# EAGLE design Cellphone-Detector-LM358 (EAGLE 7.2.0)
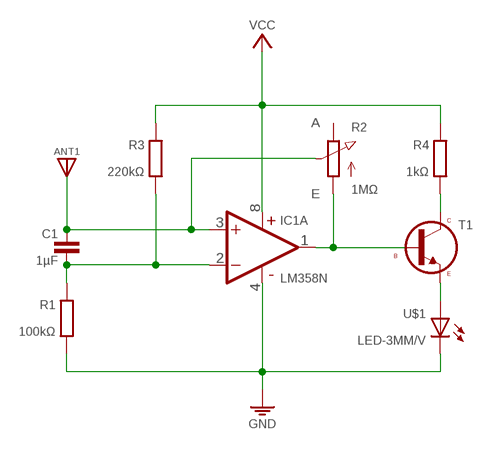
[diagram p0: schematic, sheet 1]

## Parts
ANT1  ANT  [SPAD]
C1  1µF  C025-024X044  [C025-024X044]
IC1  LM358N  [DIL08]
R1  100kΩ  R0202/7-V  [0202/7-V]
R2  1MΩ  POT-V  [POT-V]
R3  220kΩ  R0204/10-V  [0204/10-V]
R4  1kΩ  R0204/10-V  [0204/10-V]
S1  VCC_GNDPWR-R  [PWR-R]
T1  BC547  [TO92]
U$1  LED-3MM/V  [LED_3MM/V]

## Nets
GND: IC1.4(P:V-) R1.2 S1.1 U$1.K(C)
N$2: ANT1.1 C1.1 IC1.3(A:+IN) R2.S
N$3: C1.2 IC1.2(A:-IN) R1.1 R3.2
N$5: IC1.1(A:OUT) R2.A T1.2(B)
N$6: R4.2 T1.1(C)
N$7: T1.3(E) U$1.A
VCC: IC1.8(P:V+) R3.1 R4.1 S1.2
Unconnected: IC1.5(B:+IN) IC1.6(B:-IN) IC1.7(B:OUT) R2.E

## Library data of the parts
ANT1 = pad:ANT
C1 = c:C: CAPACITOR, European symbol
IC1 = ic:LM358: OP AMP also LM158; LM258; LM2904 Source: http://cache.national.com/ds/LM/LM158.pdf
R1 R3 R4 = r:R: RESISTOR, European symbol
R2 = r:POT
S1 = pad:VCC_GND
T1 = t:BC547
U$1 = d:LED

## Board
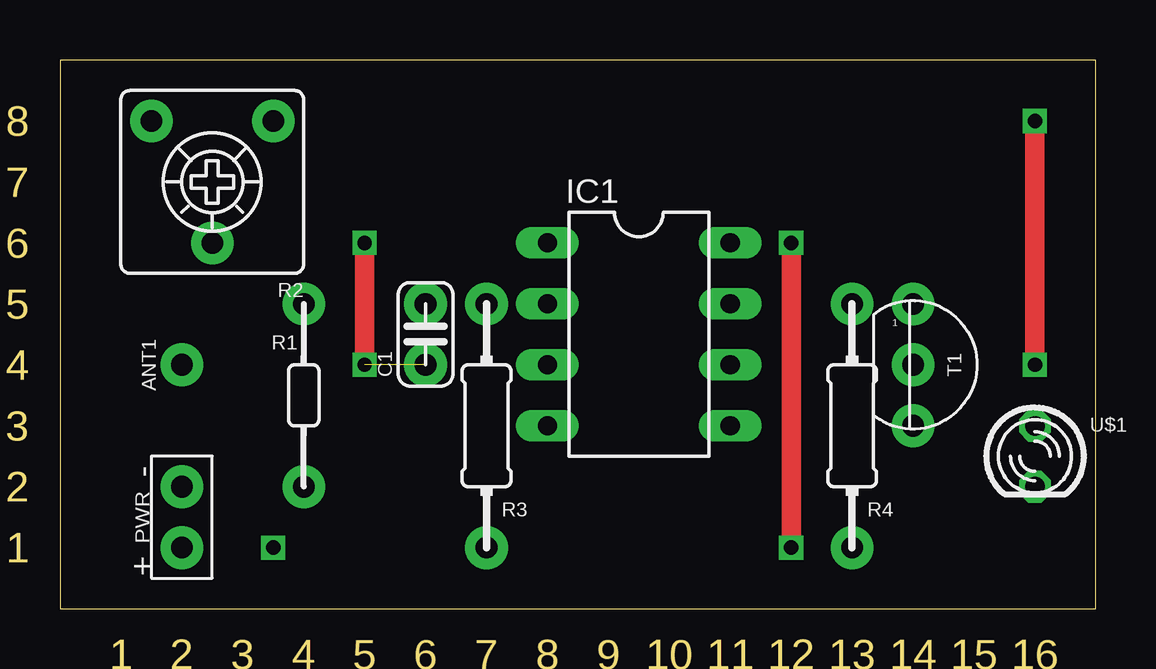
[diagram p1: board, top side]
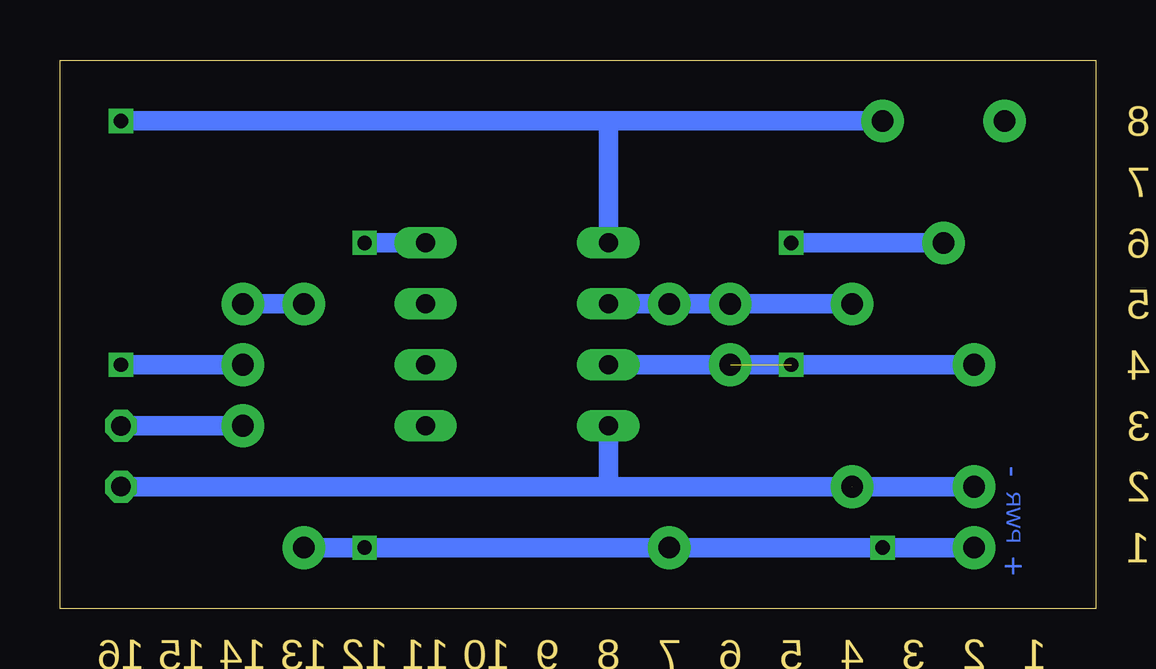
[diagram p2: board, bottom side, seen from below]

Size 43.18 x 22.86 mm. Coordinates in mm from the lower left corner, seen from the top.
Outline: 0,0 43.18,0 43.18,22.86 0,22.86 0,0
Copper layers (1*16): Top 0.035mm / dielectric 1.5mm / Bottom 0.035mm
Design rules "default": minimum track width 10mil, minimum drill 24mil, track to track 8mil, track to pad 8mil, pad to pad 8mil, via to via 8mil, smd to smd 8mil, copper to edge 40mil, drill to drill 8mil, minimum pad ring 10mil, minimum via ring 8mil, stop-mask expansion 4mil, vias tented up to drill 0mil, thermal gap 10mil

### Footprints (pad centres in the part's own frame; a part is rotated, then mirrored left to right if it is on the bottom)
SPAD = drill 0.9 pad 1.778: 1 0,0
C025-024X044 = drill 0.9 pad 1.778: 1 -1.27,0; 2 1.27,0
DIL08 = drill 0.8 pad 1.27 long: 1 -3.81,3.81; 2 -3.81,1.27; 3 -3.81,-1.27; 4 -3.81,-3.81; 5 3.81,-3.81; 6 3.81,-1.27; 7 3.81,1.27; 8 3.81,3.81
0202/7-V = drill 0.9 pad 1.778: 1 0,3.81; 2 0,-3.81
POT-V = drill 0.9 pad 1.778: A -2.54,-2.54; E 2.54,-2.54; S 0,2.54
0204/10-V = drill 0.9 pad 1.778: 1 0,5.08; 2 0,-5.08
PWR-R = drill 0.9 pad 1.778: 1 0,-1.27; 2 0,1.27
TO92 = drill 0.9 pad 1.778: 1 0,2.54; 2 0,0; 3 0,-2.54
LED_3MM/V = drill 0.813 pad 1.27 octagon: A 0,1.27; K 0,-1.27

### Placement (x,y rotation side)
ANT1  5.08,10.16 0 top
C1  15.24,11.43 90 top
IC1  24.13,11.43 0 top
R1  10.16,8.89 0 top
R2  6.35,17.78 180 top
R3  17.78,7.62 180 top
R4  33.02,7.62 180 top
S1  5.08,3.81 180 top
T1  35.56,10.16 0 top
U$1  40.64,6.35 0 top

### Tracks (layer width: path | path; a pad name or v marks a point on that pad's centre or on a via)
GND  (1 unrouted)
  Bottom 0.813: U$1.K 20.32,5.08 | IC1.4 20.32,5.08 | 20.32,5.08 R1.2 S1.1
N$2  (via drill 0.6)  (1 unrouted)
  Top 0.813: v12.7,15.24 v12.7,10.16
  Bottom 0.813: R2.S v12.7,15.24 | IC1.3 v12.7,10.16 ANT1.1
N$3
  Bottom 0.813: IC1.2 R3.2 C1.2 R1.1
N$5  (via drill 0.6)
  Top 0.813: v40.64,20.32 v40.64,10.16
  Bottom 0.813: IC1.1 20.32,20.32 v40.64,20.32 R2.A | v40.64,10.16 T1.2
N$6
  Bottom 0.813: T1.1 R4.2
N$7
  Bottom 0.813: U$1.A T1.3
VCC  (via drill 0.6)
  Top 0.813: v30.48,2.54 v30.48,15.24
  Bottom 0.813: IC1.8 v30.48,15.24 | R4.1 v30.48,2.54 R3.1 v8.89,2.54 S1.2

### Text on the board
Dimension: 8 | 7 | 6 | 5 | 4 | 3 | 2 | 1 | 1 | 2 | 3 | 4 | 5 | 6 | 7 | 8 | 9 | 10 | 11 | 12 | 13 | 14 | 15 | 16